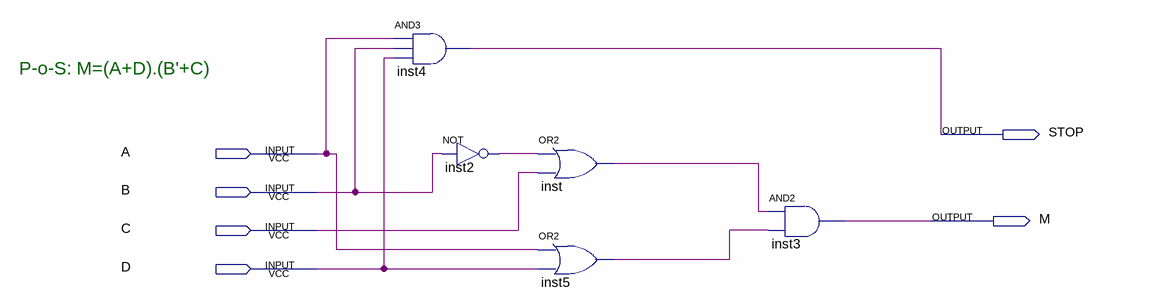
[diagram p0: schematic sheet]
// Quartus schematic MajakEA.bdf as structural Verilog: 5 symbols, 6 pins
module MajakEA (
  input  A,
  input  B,
  input  C,
  input  D,
  output STOP,
  output M
);

  wire inst2_out, inst5_out, inst_out;

  and inst4 (STOP, A, B, D);
  not inst2 (inst2_out, B);
  or inst (inst_out, inst2_out, C);
  or inst5 (inst5_out, A, D);
  and inst3 (M, inst_out, inst5_out);

  // Notes on the sheet:
  //   P-o-S: M=(A+D).(B'+C)
endmodule
